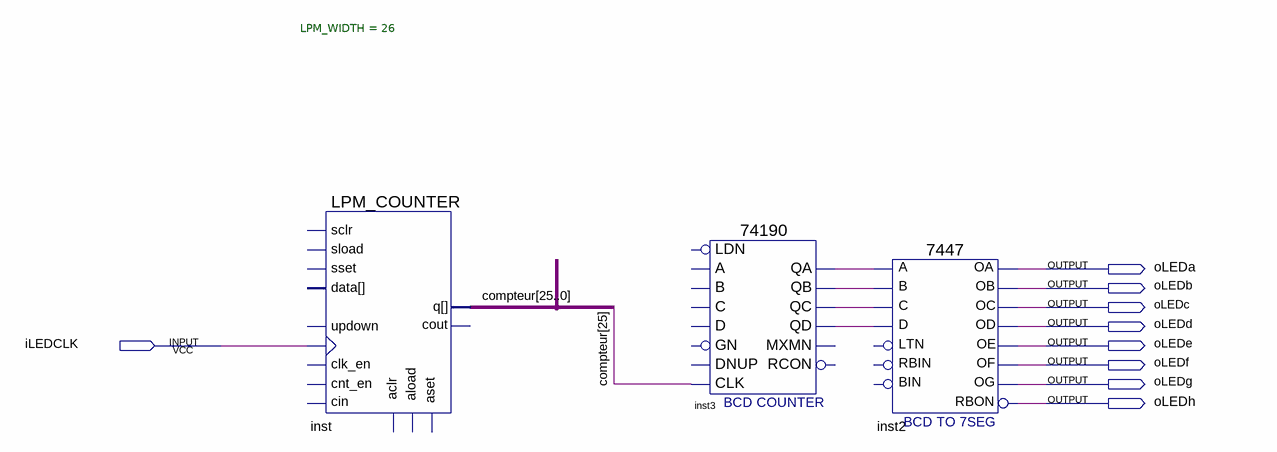
[diagram p0: schematic sheet]
// Quartus schematic TUTO_schematic.bdf as structural Verilog: 3 symbols, 9 pins
module TUTO_schematic (
  input  iLEDCLK,
  output oLEDa,
  output oLEDb,
  output oLEDc,
  output oLEDd,
  output oLEDe,
  output oLEDf,
  output oLEDg,
  output oLEDh
);

  wire inst3_qa, inst3_qb, inst3_qc, inst3_qd;
  wire [25:0] compteur;

  LPM_COUNTER #(.LPM_WIDTH(26)) inst (
    .clock(iLEDCLK), .q(compteur));  // open: sload, data, clk_en, aload, aclr, aset, cin, sset, updown, cnt_en, sclr, cout
  \74190  inst3 (
    .CLK(compteur[25]), .QA(inst3_qa), .QB(inst3_qb), .QD(inst3_qd), .QC(inst3_qc));  // open: LDN, A, C, B, D, GN, DNUP, MXMN, RCON
  \7447  inst2 (
    .B(inst3_qb), .C(inst3_qc), .D(inst3_qd), .A(inst3_qa), .OB(oLEDb), .OC(oLEDc), .OE(oLEDe), .OD(oLEDd),
    .OF(oLEDf), .OG(oLEDg), .OA(oLEDa), .RBON(oLEDh));  // open: LTN, RBIN, BIN
endmodule
